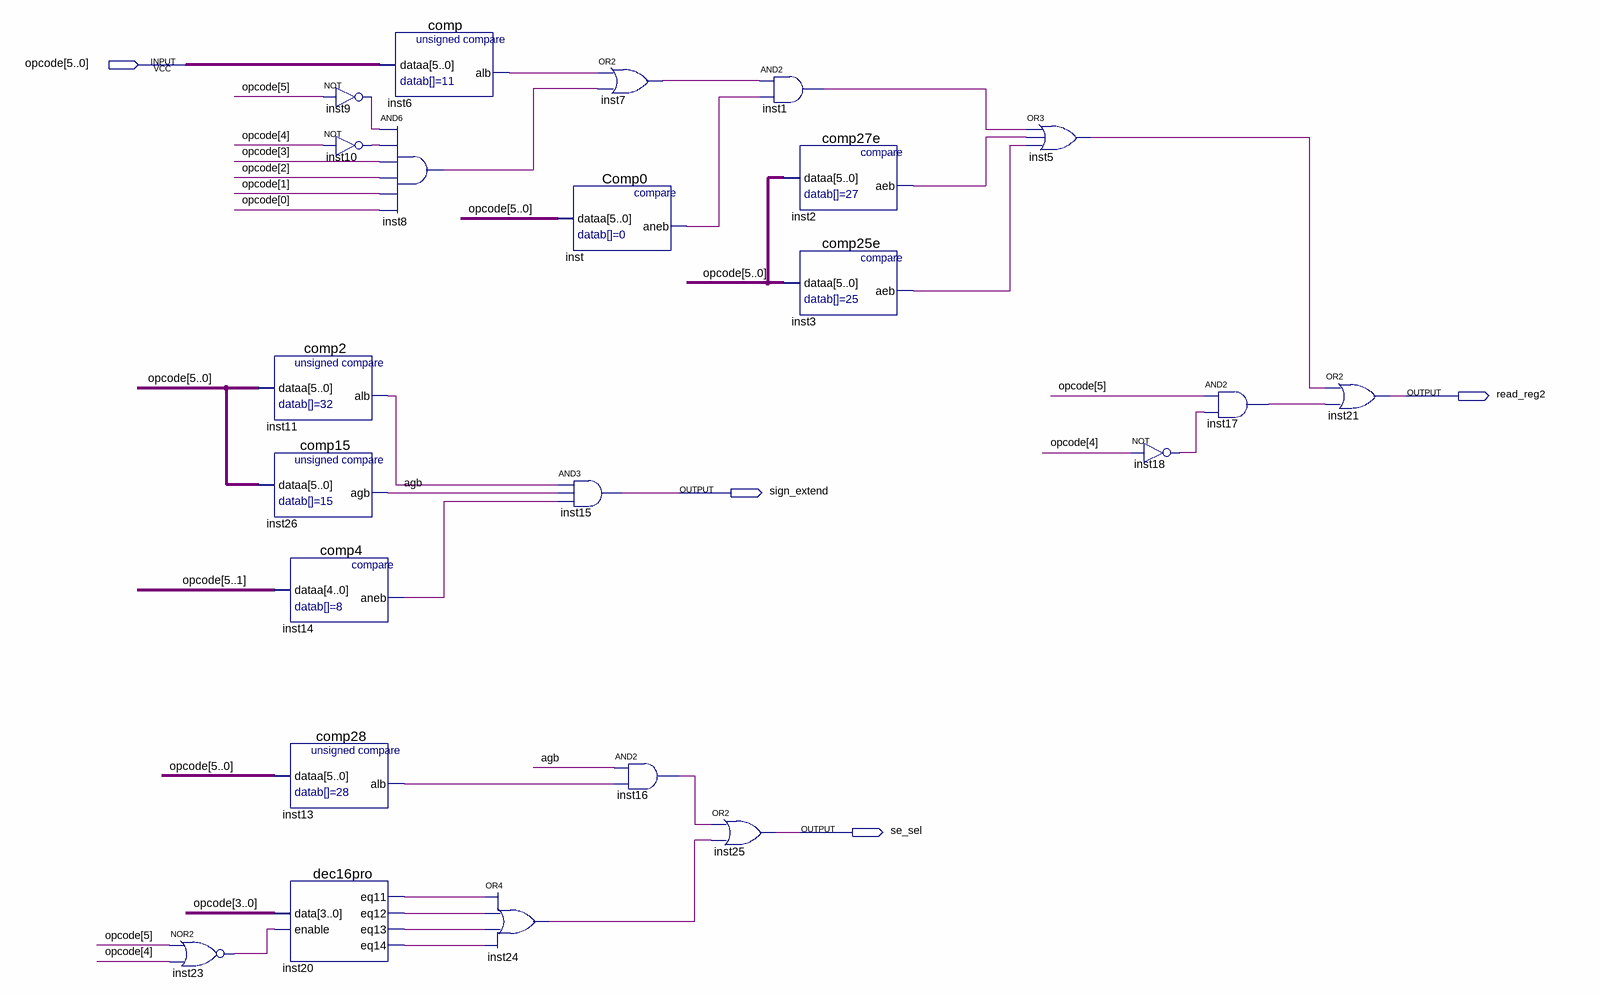
[diagram p0: schematic sheet]
// Quartus schematic ctrl_sg.bdf as structural Verilog: 23 symbols, 4 pins
module ctrl_sg (
  input  [5:0] opcode,
  output read_reg2,
  output sign_extend,
  output se_sel
);

  wire agb, inst1_out, inst2_aeb, inst3_aeb, inst5_out, inst6_alb, inst7_out, inst8_out, inst9_out,
       inst10_out, inst11_alb, inst13_alb, inst14_aneb, inst16_out, inst17_out, inst18_out, inst20_eq11,
       inst20_eq12, inst20_eq13, inst20_eq14, inst23_out, inst24_out, inst_aneb;

  nor inst23 (inst23_out, opcode[5], opcode[4]);
  comp2 inst11 (.dataa(opcode), .alb(inst11_alb));
  comp15 inst26 (.dataa(opcode), .agb(agb));
  comp4 inst14 (.dataa(opcode[5:1]), .aneb(inst14_aneb));
  comp28 inst13 (.dataa(opcode), .alb(inst13_alb));
  dec16pro inst20 (
    .data(opcode[3:0]), .enable(inst23_out), .eq11(inst20_eq11), .eq12(inst20_eq12), .eq13(inst20_eq13),
    .eq14(inst20_eq14));
  not inst9 (inst9_out, opcode[5]);
  not inst10 (inst10_out, opcode[4]);
  comp inst6 (.dataa(opcode), .alb(inst6_alb));
  and inst8 (inst8_out, inst9_out, inst10_out, opcode[3], opcode[2], opcode[1], opcode[0]);
  or inst24 (inst24_out, inst20_eq11, inst20_eq12, inst20_eq13, inst20_eq14);
  Comp0 inst (.dataa(opcode), .aneb(inst_aneb));
  and inst15 (sign_extend, inst11_alb, agb, inst14_aneb);
  or inst7 (inst7_out, inst6_alb, inst8_out);
  and inst16 (inst16_out, agb, inst13_alb);
  and inst1 (inst1_out, inst7_out, inst_aneb);
  or inst25 (se_sel, inst16_out, inst24_out);
  comp27e inst2 (.dataa(opcode), .aeb(inst2_aeb));
  comp25e inst3 (.dataa(opcode), .aeb(inst3_aeb));
  or inst5 (inst5_out, inst1_out, inst2_aeb, inst3_aeb);
  not inst18 (inst18_out, opcode[4]);
  and inst17 (inst17_out, opcode[5], inst18_out);
  or inst21 (read_reg2, inst5_out, inst17_out);
endmodule
